# Altium schematic sheet AccShelf.SchDoc
size D; SheetNumber: 1; SheetTotal: 1
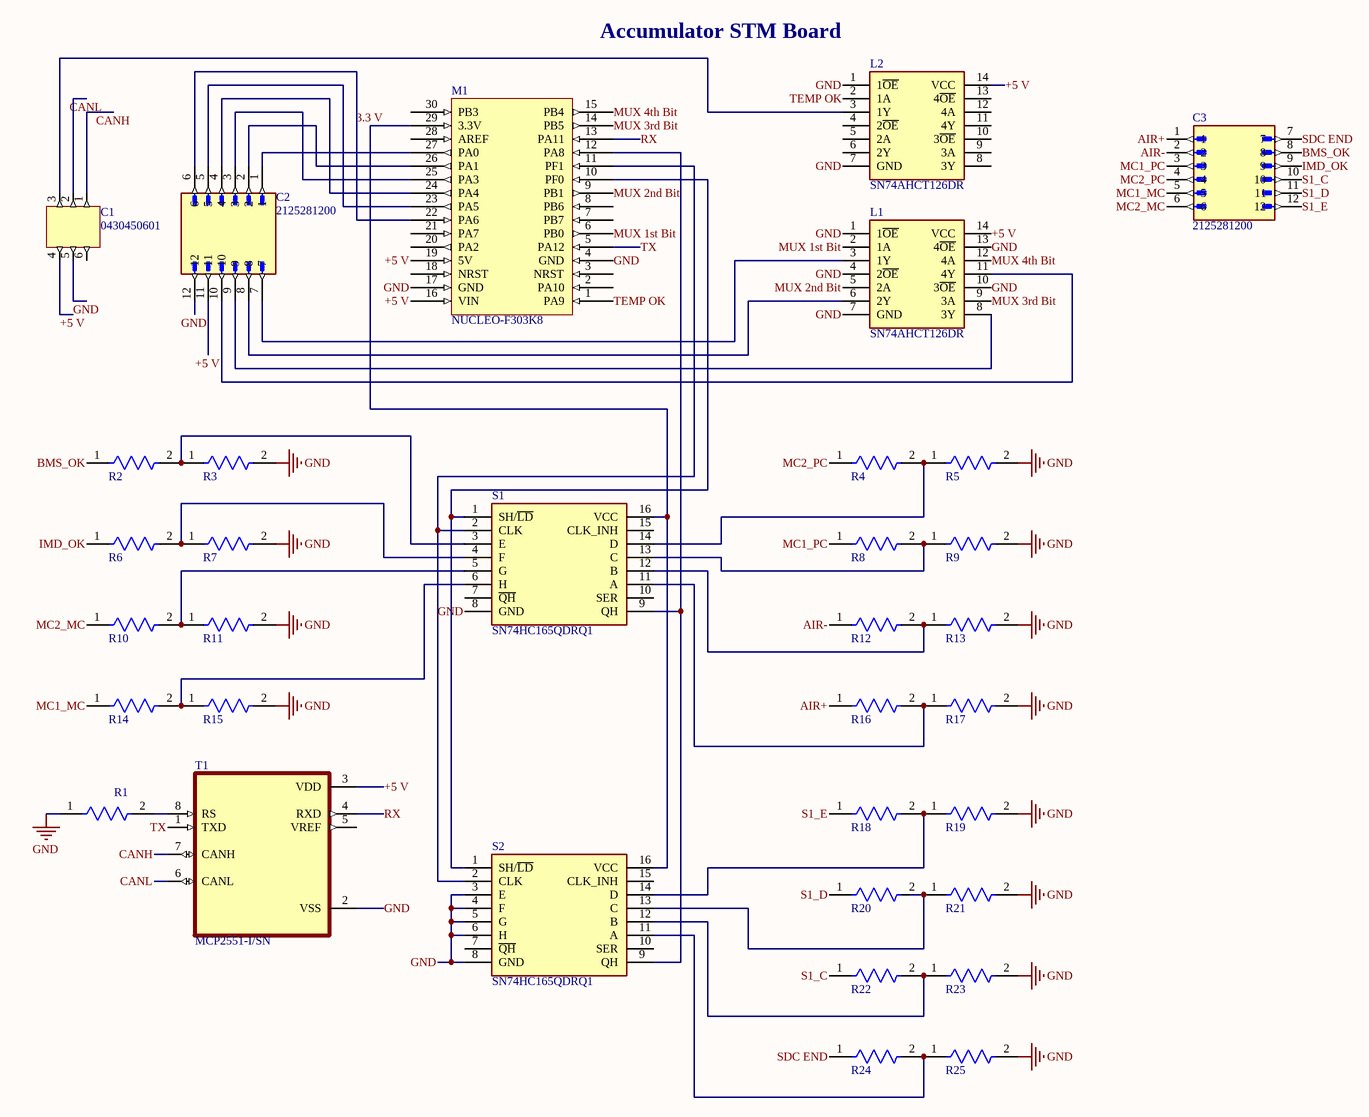
[diagram p0: AccShelf.SchDoc]

## Parts
C1  0430450601  [6 Pin Dual Connector]
C2  2125281200  [12 Pin Dual Inline Connector]
C3  2125281200  [12 Pin Dual Inline Connector]
L1  SN74AHCT126DR  [Level Shifter]
L2  SN74AHCT126DR  [Level Shifter]
M1  NUCLEO-F303K8  [STM Footprint]
R1  CRCW080510K0FKEA  [FP-CRCW0805-e3-IPC_A]  (value not drawn)
R2  CRCW0805270KFKEA  [FP-CRCW0805-e3-IPC_A]  (value not drawn)
R3  CRCW0805100KFKEA  [FP-CRCW0805-e3-MFG]  (value not drawn)
R4  CRCW0805270KFKEA  [FP-CRCW0805-e3-IPC_A]  (value not drawn)
R5  CRCW0805100KFKEA  [FP-CRCW0805-e3-MFG]  (value not drawn)
R6  CRCW0805270KFKEA  [FP-CRCW0805-e3-IPC_A]  (value not drawn)
R7  CRCW0805100KFKEA  [FP-CRCW0805-e3-MFG]  (value not drawn)
R8  CRCW0805270KFKEA  [FP-CRCW0805-e3-IPC_A]  (value not drawn)
R9  CRCW0805100KFKEA  [FP-CRCW0805-e3-MFG]  (value not drawn)
R10  CRCW0805270KFKEA  [FP-CRCW0805-e3-IPC_A]  (value not drawn)
R11  CRCW0805100KFKEA  [FP-CRCW0805-e3-MFG]  (value not drawn)
R12  CRCW0805270KFKEA  [FP-CRCW0805-e3-IPC_A]  (value not drawn)
R13  CRCW0805100KFKEA  [FP-CRCW0805-e3-MFG]  (value not drawn)
R14  CRCW0805270KFKEA  [FP-CRCW0805-e3-IPC_A]  (value not drawn)
R15  CRCW0805100KFKEA  [FP-CRCW0805-e3-MFG]  (value not drawn)
R16  CRCW0805270KFKEA  [FP-CRCW0805-e3-IPC_A]  (value not drawn)
R17  CRCW0805100KFKEA  [FP-CRCW0805-e3-MFG]  (value not drawn)
R18  CRCW0805270KFKEA  [FP-CRCW0805-e3-IPC_A]  (value not drawn)
R19  CRCW0805100KFKEA  [FP-CRCW0805-e3-MFG]  (value not drawn)
R20  CRCW0805270KFKEA  [FP-CRCW0805-e3-IPC_A]  (value not drawn)
R21  CRCW0805100KFKEA  [FP-CRCW0805-e3-MFG]  (value not drawn)
R22  CRCW0805270KFKEA  [FP-CRCW0805-e3-IPC_A]  (value not drawn)
R23  CRCW0805100KFKEA  [FP-CRCW0805-e3-MFG]  (value not drawn)
R24  CRCW0805270KFKEA  [FP-CRCW0805-e3-IPC_A]  (value not drawn)
R25  CRCW0805100KFKEA  [FP-CRCW0805-e3-MFG]  (value not drawn)
S1  SN74HC165QDRQ1  [Shift Register]
S2  SN74HC165QDRQ1  [Shift Register]
T1  MCP2551-I/SN  [CAN Transceiver]

## Nets
GND: C1.5 C2.12 L1.1(1~{OE}) L1.4(2~{OE}) L1.7(GND) L1.10(3~{OE}) L1.13(4~{OE}) L2.1(1~{OE}) L2.7(GND) M1.4(GND) M1.17(GND) R1.1 R3.2 R5.2 R7.2 R9.2 R11.2 R13.2 R15.2 R17.2 R19.2 R21.2 R23.2 R25.2 S1.8(GND) S2.3(E) S2.4(F) S2.5(G) S2.6(H) S2.8(GND) T1.2(VSS)
3.3 V: M1.29(3.3V) S1.16(VCC) S2.16(VCC)
+5 V: C1.4 C2.11 L1.14(VCC) L2.14(VCC) M1.16(VIN) M1.19(5V) T1.3(VDD)
AIR+: C3.1 R16.1
AIR-: C3.2 R12.1
BMS_OK: C3.8 R2.1
CANH: C1.1 T1.7(CANH)
CANL: C1.2 T1.6(CANL)
IMD_OK: C3.9 R6.1
MC1_MC: C3.5 R14.1
MC1_PC: C3.3 R8.1
MC2_MC: C3.6 R10.1
MC2_PC: C3.4 R4.1
MUX 1st Bit: L1.2(1A) M1.6(PB0)
MUX 2nd Bit: L1.5(2A) M1.9(PB1)
MUX 3rd Bit: L1.9(3A) M1.14(PB5)
MUX 4th Bit: L1.12(4A) M1.15(PB4)
RX: M1.13(PA11) T1.4(RXD)
S1_C: C3.10 R22.1
S1_D: C3.11 R20.1
S1_E: C3.12 R18.1
SDC END: C3.7 R24.1
TEMP OK: L2.2(1A) M1.1(PA9)
TX: M1.5(PA12) T1.1(TXD)
NetC1_3: C1.3 L2.3(1Y)
NetC2_1: C2.1 M1.27(PA0)
NetC2_2: C2.2 M1.26(PA1)
NetC2_3: C2.3 M1.25(PA3)
NetC2_4: C2.4 M1.24(PA4)
NetC2_5: C2.5 M1.23(PA5)
NetC2_6: C2.6 M1.22(PA6)
NetC2_7: C2.7 L1.3(1Y)
NetC2_8: C2.8 L1.6(2Y)
NetC2_9: C2.9 L1.8(3Y)
NetC2_10: C2.10 L1.11(4Y)
NetM1_10: M1.10(PF0) S1.1(SH/~{LD}) S2.1(SH/~{LD})
NetM1_11: M1.11(PF1) S1.2(CLK) S2.2(CLK)
NetM1_12: M1.12(PA8) S1.9(QH) S2.9(QH)
NetR1_2: R1.2 T1.8(RS)
NetR2_2: R2.2 R3.1 S1.3(E)
NetR4_2: R4.2 R5.1 S1.14(D)
NetR6_2: R6.2 R7.1 S1.4(F)
NetR8_2: R8.2 R9.1 S1.13(C)
NetR10_2: R10.2 R11.1 S1.5(G)
NetR12_2: R12.2 R13.1 S1.12(B)
NetR14_2: R14.2 R15.1 S1.6(H)
NetR16_2: R16.2 R17.1 S1.11(A)
NetR18_2: R18.2 R19.1 S2.14(D)
NetR20_2: R20.2 R21.1 S2.13(C)
NetR22_2: R22.2 R23.1 S2.12(B)
NetR24_2: R24.2 R25.1 S2.11(A)

Not connected (* = marked no-connect by the designer): C1 6; L2 4(2~{OE}) 5(2A) 6(2Y) 8(3Y) 9(3A) 10(3~{OE}) 11(4Y) 12(4A) 13(4~{OE}); M1 2(PA10) 3(NRST) 7(PB7) 8(PB6) 18(NRST) 20(PA2) 21(PA7) 28(AREF) 30(PB3); S1 7(~{QH}) 10(SER) 15(CLK_INH); S2 7(~{QH}) 10(SER) 15(CLK_INH); T1 5(VREF)

## Notes on the sheet
- Accumulator STM Board

## Library data of the parts
C1 = 0430450601: Rectangular Power Connector, 6 Contact(s), Male, Solder Terminal, Receptacle; Manufacturer: Sullins; Manufacturer Part Number: PPPC032LJBN-RC; Color: Black; Number of Positions: 6; Connector Type: Header; Pitch: 0.1inch; Option: General Purpose; Filter Feature: No; Mating Information: MULTIPLE MATING PARTS AVAILABLE; Board Mounting Option: PEG; Contact Resistance: 10mR; Contact Style: SQ PIN-SKT; Dielectric Withstanding Voltage (AC): 1.5kV; Durability: 30Cycles; Insertion Force-Max: 11.5648N; Insulation Resistance: 1GR; Number Of Connectors: 1; Number of Rows Loaded: 2; Withdrawl Force-Min: 3.0024N; Polarization Key: POLARIZED HOUSING; Rated Current (Signal): 5A; Body Breadth: 0.345inch; Body Depth: 0.48inch; Body Length: 0.498inch; Mounting Option 1: POLARIZED LCK; Plating Thickness: 15uin; Mating Contact Pitch: 0.118inch; Mounting Option 2: LOCKING; PCB Contact Row Spacing: 2.9972mm; Reference Standard: UL; Reliability: COMMERCIAL; Supplier: Digi-Key; Supplier Part Number: S5556-ND; RoHS: Yes; Category: Connectors; Stock: 1878; Pricing: 1=0.87000, 10=0.73600, 100=0.66130, 500=0.54108, 1000=0.48096, 5000=0.43420 (USD); Mounting Technology: Through Hole; Contact Plating: Gold; Contact Material: Bronze; Housing Color: Black; Housing Material: Plastic; Package Quantity: 1000; Number of Rows: 2; Packaging: Bulk; Termination: Solder; Contact Type: Female Socket; Length: 8.12mm; Width: 8.5mm; Height: 5mm; Row Spacing: 0.1inch; Lead Free: Lead Free; RoHS Compliant: Yes; ComponentLink1URL: https://drawings-pdf.s3.amazonaws.com/10494.pdf?src-supplier=Digi-Key; ComponentLink1Description: https://drawings-pdf.s3.amazonaws.com/10494.pdf?src-supplier=Digi-Key; ComponentLink2URL: http://www.farnell.com/datasheets/2696385.pdf?src-supplier=Farnell; ComponentLink2Description: http://www.farnell.com/datasheets/2696385.pdf?src-supplier=Farnell; ComponentLink3URL: http://www.farnell.com/datasheets/2696385.pdf?src-supplier=Newark; ComponentLink3Description: http://www.farnell.com/datasheets/2696385.pdf?src-supplier=Newark; ComponentLink4URL: http://www.farnell.com/datasheets/2696385.pdf?src-supplier=Element14; ComponentLink4Description: http://www.farnell.com/datasheets/2696385.pdf?src-supplier=Element14; Contact Finish - Mating: MATTE TIN; Contact Finish - Termination: Matte Tin (Sn) - with Nickel (Ni) barrier; Insulation Color: Black; Insulation Material: Polymer; Shell Material: Polymer; Min Operating Temperature: -40°C; Max Operating Temperature: 105°C; JESD-609 Code: e3; Contact Gender: Male; Mixed Contacts: No; Mounting Style: RIGHT ANGLE; Number of Contacts: 6; Body/Shell Style: RECEPTACLE; Empty Shell: No; Contact Pattern: RECTANGULAR; Number Of PCB Rows: 2; PCB Contact Pattern: RECTANGULAR; Terminal Length: 0.125inch; Terminal Pitch: 2.9972mm; Mating Contact Row Spacing: 0.118inch; Flammability Rating: UL94 V-0; DIN Conformance: No; IEC Conformance: No; MIL Conformance: No; Reach SVHC Compliant: Yes; ComponentLink5URL: https://datasheet.ciiva.com:443/pdfs/VipMasterIC/IC/MOLE/MOLE-S-A0003536766/MOLE-S-A0003536766-1.pdf?src-supplier=IHS+Markit; ComponentLink5Description: https://datasheet.ciiva.com:443/pdfs/VipMasterIC/IC/MOLE/MOLE-S-A0003536766/MOLE-S-A0003536766-1.pdf?src-supplier=IHS+Markit
C2 C3 = 2125281200: Conn Micro-Fit Power HDR 12 POS 3mm Solder RA Through Hole 12 Terminal Single Port Tray; Manufacturer: Molex; Manufacturer Part Number: 212528-1200; MF: {'manufacturer': u'Molex'}; Value: *; MP: 2125281200; Availability: Unavailable; Price: None; Package: None; Supplier: Mouser; Supplier Part Number: 538-212528-1200; RoHS: No; Category: Headers and Wire Housings; Stock: 1070; Pricing: 1=3.35000, 10=2.96000, 50=2.96000, 100=2.96000, 1000=2.28000, 10000=1.94000 (USD); ComponentLink1URL: http://datasheet.octopart.com/2125281200-Molex-datasheet-147959482.pdf?src-supplier=Rs; ComponentLink1Description: http://datasheet.octopart.com/2125281200-Molex-datasheet-147959482.pdf?src-supplier=Rs
L1 L2 = SN74AHCT126DR: Bus Driver, AHCT/VHCT/VT Series, 4-Func, 1-Bit, True Output, CMOS, PDSO14; Manufacturer_Name: Diodes Inc.; Manufacturer_Part_Number: 74AHCT125S14-13; Manufacturer: Diodes; Geometry.Height: 1.73mm; Package Body Material: Plastic; Control Type: ENABLE LOW; Load Capacitance (CL): 50pF; Max I(ol): 8mA; Number of Bits: 1; Channels: 4; Number of Ports: 2; Output Characteristics: 3-STATE; Package Equivalence Code: SOP14,.25; Power Supplies: 5V; Power Supply Current-Max (ICC): 40uA; Prop. Delay@Nom-Sup: 9.5ns; Max Supply Voltage: 5.5V; Min Supply Voltage: 4.5V; Time @ Peak Reflow Temperature-Max (s): 40s; Qualification Status: Not Qualified; Mouser Part Number: 621-74AHCT125S14-13; Mouser Price/Stock: https://www.mouser.co.uk/ProductDetail/Diodes-Incorporated/74AHCT125S14-13?qs=pYVYkI7xuRUA0d%2Fp2SGl5A%3D%3D; Arrow Part Number: 74AHCT125S14-13; Arrow Price/Stock: https://www.arrow.com/en/products/74ahct125s14-13/diodes-incorporated?region=nac; Datasheet Link: http://uk.rs-online.com/web/p/products/7988941; Supplier: Avnet; Supplier Part Number: 74AHCT125S14-13; Manufacturer Part Number: 74AHCT125S14-13; RoHS: Yes; Category: Buffers, Drivers and Transceivers; Stock: 22500; Pricing: 2500=0.06080, 5000=0.05862, 10000=0.05686, 15000=0.05520, 20000=0.05312, 25000=0.05229, 250000=0.05146 (USD); Case/Package: SOP; Pins: 14; Package Shape: Rectangular; Terminal Finish: Tin; Min Operating Temperature: -40°C; Max Operating Temperature: 125°C; JESD-609 Code: e3; Output Polarity: True; JESD-30 Code: R-PDSO-G14; Logic Type: BUS DRIVER; Moisture Sensitivity Level: 1; Package Style: SMALL OUTLINEMeter; Packaging: Tape and Reel; Peak Reflow Temperature (Cel): 260°C; Propagation Delay (tpd): 9.5ns; Nominal Supply Voltage: 5V; Surface Mount: Yes; Technology: CMOS; Terminal Form: Gull Wing; Terminal Position: DUAL; Length: 8.635mm; Width: 3.895mm; Height - Seated (Max): 1.73mm; Terminal Pitch: 1.27mm; Temperature Grade: AUTOMOTIVE; Reach SVHC Compliant: Yes; RoHS Compliant: Yes; ComponentLink1URL: https://datasheet.ciiva.com:443/pdfs/VipMasterIC/IC/DIOD/DIODS15860/DIODS15860-1.pdf?src-supplier=IHS+Markit; ComponentLink1Description: https://datasheet.ciiva.com:443/pdfs/VipMasterIC/IC/DIOD/DIODS15860/DIODS15860-1.pdf?src-supplier=IHS+Markit; ComponentLink2URL: https://datasheet.ciiva.com/25651/74ahct125-25651120.pdf?src-supplier=Digi-Key; ComponentLink2Description: https://datasheet.ciiva.com/25651/74ahct125-25651120.pdf?src-supplier=Digi-Key; ComponentLink3URL: https://datasheet.ciiva.com/29883/74ahct125-29883446.pdf?src-supplier=Avnet; ComponentLink3Description: https://datasheet.ciiva.com/29883/74ahct125-29883446.pdf?src-supplier=Avnet; ComponentLink4URL: https://www.ti.com:443/lit/ds/symlink/sn54ahct126.pdf?src-supplier=IHS+Markit; ComponentLink4Description: https://www.ti.com:443/lit/ds/symlink/sn54ahct126.pdf?src-supplier=IHS+Markit; ComponentLink5URL: https://datasheet.ciiva.com/1833/sn74ahct126-1833860.pdf?src-supplier=Digi-Key; ComponentLink5Description: https://datasheet.ciiva.com/1833/sn74ahct126-1833860.pdf?src-supplier=Digi-Key; ComponentLink6URL: https://datasheet.ciiva.com/1833/sn74ahct126-1833859.pdf?src-supplier=Digi-Key; ComponentLink6Description: https://datasheet.ciiva.com/1833/sn74ahct126-1833859.pdf?src-supplier=Digi-Key; ComponentLink7URL: https://datasheet.ciiva.com/1833/sn74ahct126-1833861.pdf?src-supplier=Digi-Key; ComponentLink7Description: https://datasheet.ciiva.com/1833/sn74ahct126-1833861.pdf?src-supplier=Digi-Key; ComponentLink8URL: https://datasheet.ciiva.com/14318/sn74ahct126-14318567.pdf?src-supplier=Avnet; ComponentLink8Description: https://datasheet.ciiva.com/14318/sn74ahct126-14318567.pdf?src-supplier=Avnet; ComponentLink9URL: https://datasheet.ciiva.com/48702/001075227-da-01-en-ic-bus-buffer-sn74ahct126dr-soic-14-tid-48702247.pdf?src-supplier=Conrad; ComponentLink9Description: https://datasheet.ciiva.com/48702/001075227-da-01-en-ic-bus-buffer-sn74ahct126dr-soic-14-tid-48702247.pdf?src-supplier=Conrad
M1 = NUCLEO-F303K8: Boards/Accessories; Manufacturer: STMicroelectronics; Evaluation Kit: Yes; Number of Bits: 32; Core Architecture: ARM; Supplier: Newark; Supplier Part Number: 68Y1244; Manufacturer Part Number: NUCLEO-F303K8; RoHS: No; Category: Embedded Processors and Controllers; Stock: 226; Pricing: 1=10.33000 (USD); Series: STM32F3; Reach SVHC Compliant: Yes; Lead Free: Lead Free; ComponentLink1URL: http://www.farnell.com/datasheets/2064195.pdf?src-supplier=Farnell; ComponentLink1Description: http://www.farnell.com/datasheets/2064195.pdf?src-supplier=Farnell; ComponentLink2URL: http://www.st.com/content/ccc/resource/technical/document/data_brief/b1/d8/13/d4/b0/b7/4b/6e/DM00214578.pdf/files/DM00214578.pdf/jcr:content/translations/en.DM00214578.pdf?src-supplier=Digi-Key; ComponentLink2Description: http://www.st.com/content/ccc/resource/technical/document/data_brief/b1/d8/13/d4/b0/b7/4b/6e/DM00214578.pdf/files/DM00214578.pdf/jcr:content/translations/en.DM00214578.pdf?src-supplier=Digi-Key; ComponentLink3URL: http://www.st.com/st-web-ui/static/active/en/resource/technical/document/user_manual/DM00116575.pdf?s_searchtype=keyword&src-supplier=Avnet; ComponentLink3Description: http://www.st.com/st-web-ui/static/active/en/resource/technical/document/user_manual/DM00116575.pdf?s_searchtype=keyword&src-supplier=Avnet; ComponentLink4URL: http://www.farnell.com/datasheets/1966773.pdf?src-supplier=Element14; ComponentLink4Description: http://www.farnell.com/datasheets/1966773.pdf?src-supplier=Element14; ComponentLink5URL: http://www.farnell.com/datasheets/2064195.pdf?src-supplier=Newark; ComponentLink5Description: http://www.farnell.com/datasheets/2064195.pdf?src-supplier=Newark
R1 = CMP-2001-04908-2: RES Thick Film, 10kΩ, 1%, 0.125W, 100ppm/°C, 0805; Manufacturer: Vishay; Resistance: 10kR; Voltage Rating (DC): 150V; Power Rating: 125mW; Rated Temperature: 70°C; Value: 10kR; Package Height: 0.45mm; Package Length: 2mm; Package Width: 1.25mm; Reference Standard: AEC-Q200; Weight: 0.000194oz; Package Quantity: 5000; Military Standard: Not; Max Operating Temperature: 155°C; Temperature Coefficient: 100ppm/°C; Contact Plating: Tin; Width: 1.25mm; Height: 0.45mm; Radiation Hardening: No; Tolerance: 1%; Min Operating Temperature: -55°C; Voltage Rating: 150V; Length: 2mm; Depth: 1.25mm; Termination: SMD/SMT; Packaging: Tape and Reel; Case/Package: 0805; Case Code (Metric): 2012; Lead Free: Lead Free; Case Code (Imperial): 0805; Composition: Thick Film; Supplier: Newark; Supplier Part Number: 24W3284; Manufacturer Part Number: CRCW080510K0FKEA; RoHS: Yes; Category: Chip SMD Resistors; Stock: 980000; Pricing: 1=0.00800, 5000=0.00800 (USD); Mounting Technology: Surface Mount; Pins: 2; Terminal Finish: Nickel; Package Shape: Rectangular; Resistor Type: FIXED RESISTOR; Power: 125mW; Technology: METAL GLAZE/THICK FILM; Working Voltage: 150V; Construction: Chip; Package Style: SMTMeter; JESD-609 Code: e3; RoHS Compliant: Yes; Reach SVHC Compliant: Yes; ComponentLink1URL: https://datasheet.ciiva.com:443/pdfs/VipMasterIC/IC/VISH/VISH-S-A0007266705/VISH-S-A0007266705-1.pdf?src-supplier=IHS+Markit; ComponentLink1Description: https://datasheet.ciiva.com:443/pdfs/VipMasterIC/IC/VISH/VISH-S-A0007266705/VISH-S-A0007266705-1.pdf?src-supplier=IHS+Markit; ComponentLink2URL: https://datasheet.ciiva.com/46394/1720486-46394381.pdf?src-supplier=Element14; ComponentLink2Description: https://datasheet.ciiva.com/46394/1720486-46394381.pdf?src-supplier=Element14; ComponentLink3URL: https://datasheet.ciiva.com/16719/70201119-16719082.pdf?src-supplier=Allied+Electronics; ComponentLink3Description: https://datasheet.ciiva.com/16719/70201119-16719082.pdf?src-supplier=Allied+Electronics; ComponentLink4URL: https://datasheet.ciiva.com/16755/70201119-16755389.pdf?src-supplier=Allied+Electronics; ComponentLink4Description: https://datasheet.ciiva.com/16755/70201119-16755389.pdf?src-supplier=Allied+Electronics; ComponentLink5URL: https://datasheet.ciiva.com/5547/dcrcwe3-109170-5547559.pdf?src-supplier=Mouser; ComponentLink5Description: https://datasheet.ciiva.com/5547/dcrcwe3-109170-5547559.pdf?src-supplier=Mouser
R2 R4 R6 R8 R10 R12 R14 R16 R18 R20 R22 R24 = CMP-2001-03733-2: RES Thick Film, 270kΩ, 1%, 0.125W, 100ppm/°C, 0805; Voltage Rating: 150V; Power Rating: 125mW; Resistance: 270kR; Case/Package: 0805; Number of Pins: 2; Width: 1.25mm; Depth: 1.25mm; Case Code (Metric): 2012; Min Operating Temperature: -55°C; Radiation Hardening: No; Tolerance: 1%; Length: 2mm; Termination: SMD/SMT; Weight: 0.000194oz; Packaging: Tape and Reel; Composition: Thick Film; Temperature Coefficient: 100ppm/°C; Lead Free: Lead Free; Height: 0.45mm; Max Operating Temperature: 155°C; Case Code (Imperial): 0805; Package Quantity: 5000; Voltage Rating (DC): 150V; Contact Plating: Tin; Military Standard: Not
R3 R5 R7 R9 R11 R13 R15 R17 R19 R21 R23 R25 = CMP-2001-04899-2: RES Thick Film, 100kΩ, 1%, 0.125W, 100ppm/°C, 0805; Resistance: 100kR; Power Rating: 125mW; Voltage Rating: 150V; Case/Package: 0805; Max Operating Temperature: 155°C; Case Code (Imperial): 0805; Lead Free: Lead Free; Weight: 0.000194oz; Number of Pins: 2; Package Quantity: 5000; Height: 0.45mm; Composition: Thick Film; Military Standard: Not; Tolerance: 1%; Case Code (Metric): 2012; Termination: SMD/SMT; Mount: Surface Mount; Radiation Hardening: No; Width: 1.25mm; Length: 2mm; Depth: 1.25mm; Packaging: Tape and Reel; Min Operating Temperature: -55°C; Contact Plating: Tin; Temperature Coefficient: 100ppm/°C; Voltage Rating (DC): 150V
S1 S2 = SN74HC165QDRQ1: Parallel In Serial Out, HC Series, 8-Bit, Right Direction, Complementary Output, CMOS, PDSO16; Manufacturer_Name: Texas Instruments; Geometry.Height: 1.75mm; Package Body Material: Plastic; Clock Edge Trigger Type: Positive Edge; Number of Bits: 8; Channels: 1; Package Equivalence Code: SOP16,.25; Power Supplies: 2/6V; Max Supply Voltage: 6V; Min Supply Voltage: 2V; Nominal Supply Voltage: 5V; fmax-Min: 25MHz; Propagation Delay (tpd): 225ns; Qualification Status: Not Qualified; Manufacturer_Part_Number: SN74HC165QDRQ1; Mouser Part Number: 595-SN74HC165QDRQ1; Mouser Price/Stock: https://www.mouser.co.uk/ProductDetail/Texas-Instruments/SN74HC165QDRQ1?qs=AgY10sKTvDLN6%2Fwfup846w%3D%3D; Arrow Part Number: SN74HC165QDRQ1; Arrow Price/Stock: https://www.arrow.com/en/products/sn74hc165qdrq1/texas-instruments; Datasheet Link: http://www.ti.com/lit/gpn/sn74hc165-q1; Supplier: Digi-Key; Supplier Part Number: 296-35928-1-ND; Manufacturer: Texas Instruments; Manufacturer Part Number: SN74HC165QDRQ1; RoHS: Yes; Category: Shift Registers; Pricing: 1=0.62000, 10=0.54200, 25=0.50920, 100=0.41570, 250=0.38612, 500=0.32860, 1000=0.26288 (USD); Case/Package: SOP; Pins: 16; Package Shape: Rectangular; Terminal Finish: Nickel; Min Operating Temperature: -40°C; Max Operating Temperature: 125°C; JESD-609 Code: e4; Output Polarity: Complementary; Count Direction: RIGHT; JESD-30 Code: R-PDSO-G16; Logic Type: PARALLEL IN SERIAL OUT; Moisture Sensitivity Level: 1; Package Style: SMALL OUTLINEMeter; Peak Reflow Temperature (Cel): 260°C; Surface Mount: Yes; Technology: CMOS; Terminal Form: Gull Wing; Terminal Position: DUAL; Max Frequency@Nom-Sup: 25MHz; Length: 9.9mm; Width: 3.9mm; Height - Seated (Max): 1.75mm; Terminal Pitch: 1.27mm; Temperature Grade: AUTOMOTIVE; Reach SVHC Compliant: Yes; RoHS Compliant: Yes; ComponentLink1URL: https://www.ti.com:443/lit/ds/symlink/sn74hc165-q1.pdf?src-supplier=IHS+Markit; ComponentLink1Description: https://www.ti.com:443/lit/ds/symlink/sn74hc165-q1.pdf?src-supplier=IHS+Markit; ComponentLink2URL: https://datasheet.ciiva.com/18575/sn74hc165-q1-18575046.pdf?src-supplier=Digi-Key; ComponentLink2Description: https://datasheet.ciiva.com/18575/sn74hc165-q1-18575046.pdf?src-supplier=Digi-Key; ComponentLink3URL: https://datasheet.ciiva.com/18575/sn74hc165-q1-18575047.pdf?src-supplier=Digi-Key; ComponentLink3Description: https://datasheet.ciiva.com/18575/sn74hc165-q1-18575047.pdf?src-supplier=Digi-Key; ComponentLink4URL: https://datasheet.ciiva.com/18575/sn74hc165-q1-18575048.pdf?src-supplier=Digi-Key; ComponentLink4Description: https://datasheet.ciiva.com/18575/sn74hc165-q1-18575048.pdf?src-supplier=Digi-Key; ComponentLink5URL: https://datasheet.ciiva.com/48704/001074775-da-01-en-ic-shift-regi-sn74hc165qdrq1-soic-16-tid-48704119.pdf?src-supplier=Conrad; ComponentLink5Description: https://datasheet.ciiva.com/48704/001074775-da-01-en-ic-shift-regi-sn74hc165qdrq1-soic-16-tid-48704119.pdf?src-supplier=Conrad
T1 = MCP2551-I/SN: CAN Transceiver, 1-Trnsvr, PDSO8; Manufacturer: Microchip; Number of Terminals/Pins: 8; Package Body Material: Plastic; Max Supply Voltage: 5.5V; Min Supply Voltage: 4.5V; Data Rate: 1Mbps; Operating Supply Voltage: 5V; Nominal Supply Current: 75mA; Interface: Serial,CAN; Number of Transceivers: 1; Slew Rate: 8.5V/µs; Time @ Peak Reflow Temperature-Max (s): 40s; Package Equivalence Code: SOP8,.25; Telecom IC Type: INTERFACE CIRCUIT; Qualification Status: Not Qualified; Package: None; MP: MCP2551-I/SN; Price: None; Availability: Unavailable; Value: *; Supplier: Newark; Supplier Part Number: 69K7604; Manufacturer Part Number: MCP2551-I/SN; RoHS: Yes; Category: Interface ICs; Stock: 47560; Pricing: 1=1.37000, 10=1.32000, 25=1.26000, 50=1.26000, 100=1.25000 (USD); Mounting Technology: Surface Mount; Case/Package: SOIC; Pins: 8; Contact Plating: Tin,Matte; Package Shape: Rectangular; Terminal Finish: Tin; Min Operating Temperature: -40°C; Max Operating Temperature: 85°C; Packaging: Rail/Tube; Package Quantity: 100; Supply Current: 75mA; Number of Transmit Buffers: 1; Number of Receive Buffers: 1; Max Supply Current: 75mA; Number of Drivers: 1; Number of Receivers: 1; Logic Function: Transceiver; Channels: 1; Nominal Supply Voltage: 5.5V; JESD-30 Code: R-PDSO-G8; Moisture Sensitivity Level: 1; Peak Reflow Temperature (Cel): 260°C; Surface Mount: Yes; Terminal Form: Gull Wing; Terminal Position: DUAL; Length: 4.9mm; Width: 3.9mm; Height: 1.25mm; Radiation Hardening: No; Reach SVHC Compliant: Yes; RoHS Compliant: Yes; Lead Free: Lead Free; Temperature Grade: INDUSTRIAL; ComponentLink1URL: https://datasheet.ciiva.com/27056/2040583-27056423.pdf?src-supplier=Jameco; ComponentLink1Description: https://datasheet.ciiva.com/27056/2040583-27056423.pdf?src-supplier=Jameco; ComponentLink2URL: https://datasheet.ciiva.com/8084/jp011797-8084592.pdf?src-supplier=Avnet; ComponentLink2Description: https://datasheet.ciiva.com/8084/jp011797-8084592.pdf?src-supplier=Avnet; ComponentLink3URL: https://datasheet.ciiva.com/14152/eb644223-644224-e-14152540.pdf?src-supplier=Distrelec; ComponentLink3Description: https://datasheet.ciiva.com/14152/eb644223-644224-e-14152540.pdf?src-supplier=Distrelec; ComponentLink4URL: https://datasheet.ciiva.com/1495/21667f-1495089.pdf?src-supplier=Element14; ComponentLink4Description: https://datasheet.ciiva.com/1495/21667f-1495089.pdf?src-supplier=Element14; ComponentLink5URL: https://datasheet.ciiva.com/1700/21667f-1700023.pdf?src-supplier=Digi-Key; ComponentLink5Description: https://datasheet.ciiva.com/1700/21667f-1700023.pdf?src-supplier=Digi-Key; Package Style: SMALL OUTLINEMeter; JESD-609 Code: e3; Power Supplies: 5V; Technology: CMOS; Height - Seated (Max): 1.75mm; Terminal Pitch: 1.27mm; ComponentLink6URL: https://datasheet.ciiva.com:443/pdfs/VipMasterIC/IC/MCHP/MCHP-S-A0002782162/MCHP-S-A0002782162-1.pdf?src-supplier=IHS+Markit; ComponentLink6Description: https://datasheet.ciiva.com:443/pdfs/VipMasterIC/IC/MCHP/MCHP-S-A0002782162/MCHP-S-A0002782162-1.pdf?src-supplier=IHS+Markit